# EAGLE design ev_emulator (EAGLE 9.2.2)
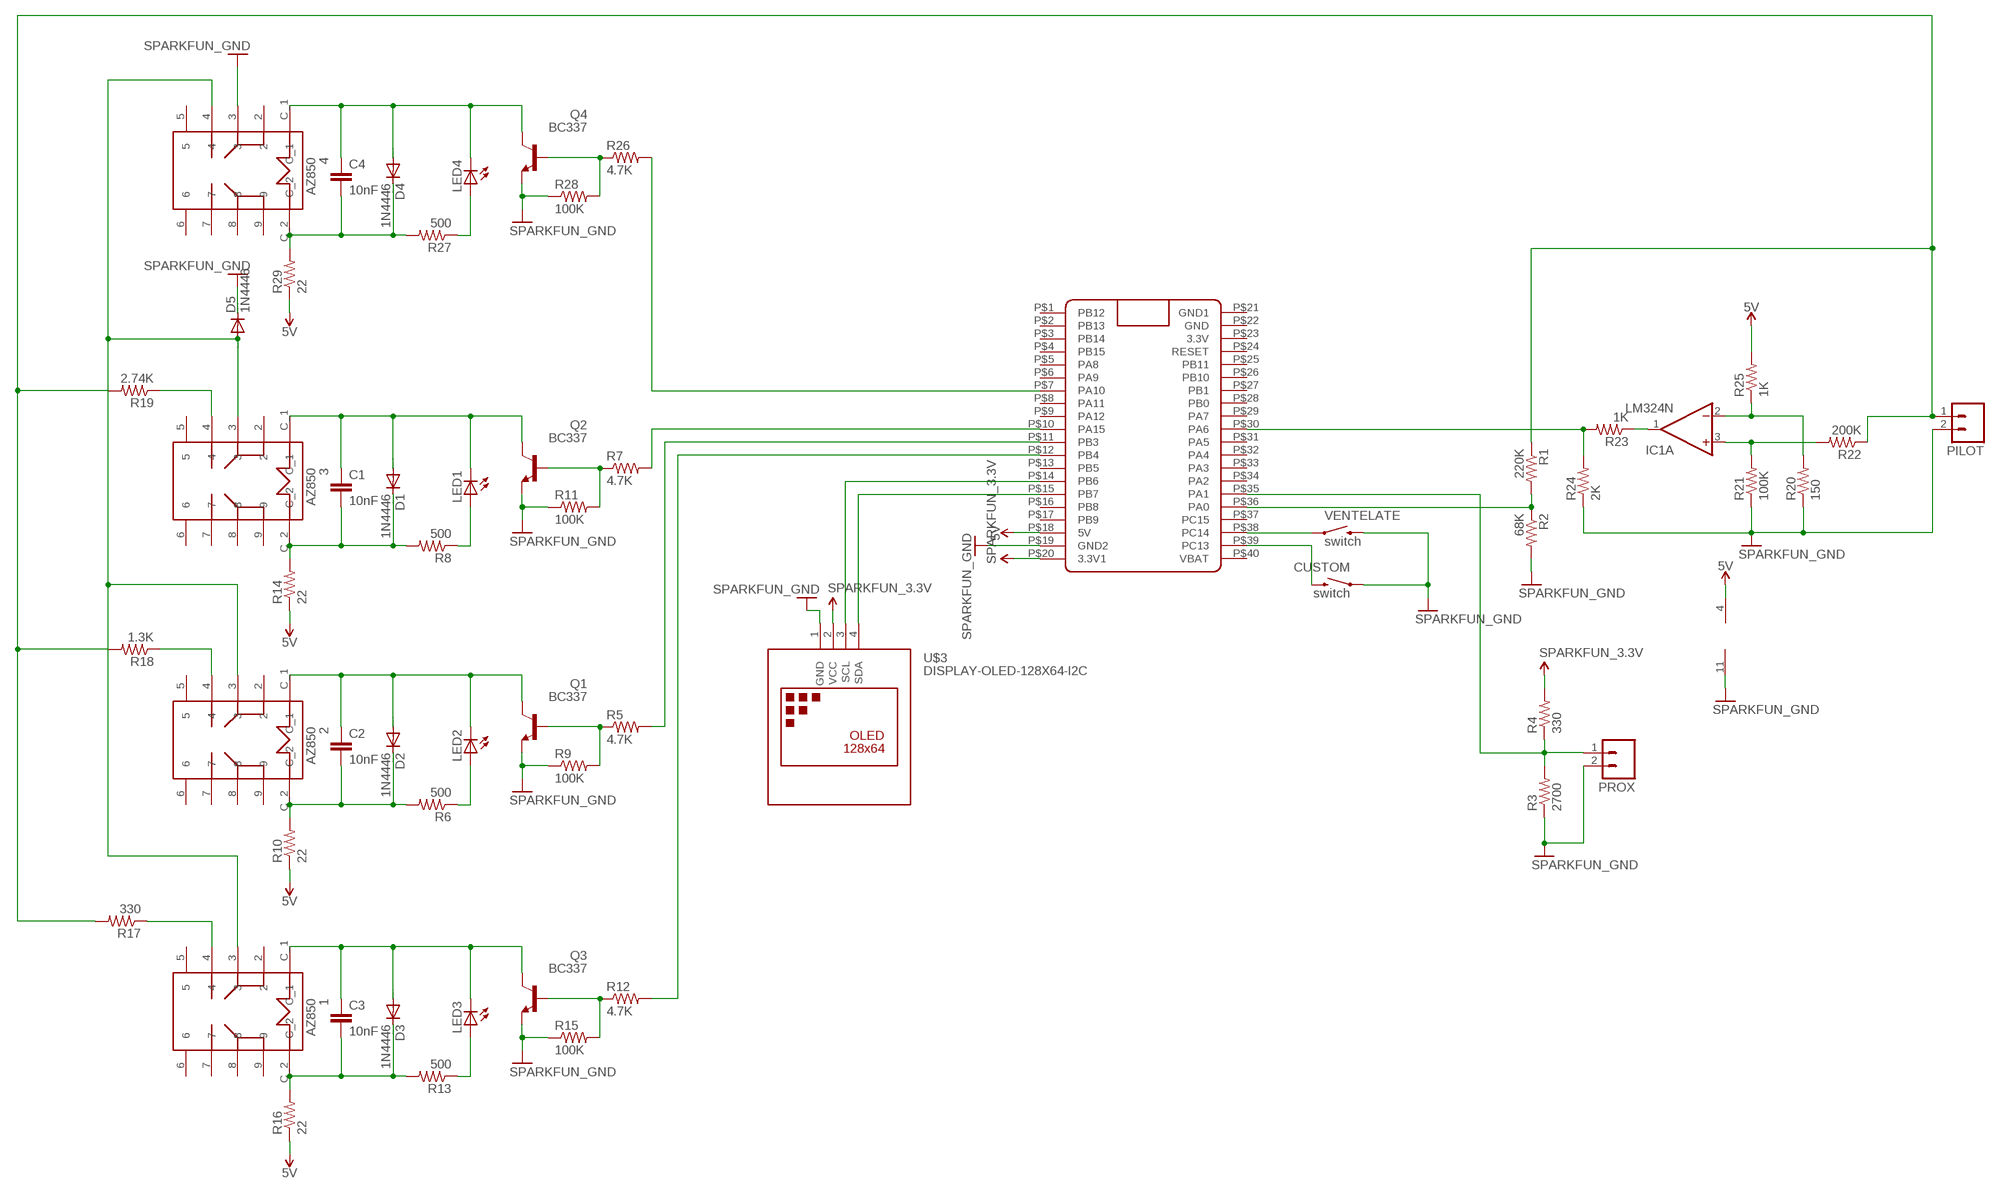
[diagram p0: schematic, sheet 1]

## Parts
1  AZ850  [AZ850]
2  AZ850  [AZ850]
3  AZ850  [AZ850]
4  AZ850  [AZ850]
C1  10nF  C2,5-3  [C2.5-3]
C2  10nF  C2,5-3  [C2.5-3]
C3  10nF  C2,5-3  [C2.5-3]
C4  10nF  C2,5-3  [C2.5-3]
CUSTOM  switch  SPARKFUN-ELECTROMECHANICAL_SWITCH-MOMENTARY-2PTH  [SPARKFUN-ELECTROMECHANICAL_TACTILE-PTH]
D1  1N4446  [DO35-10]
D2  1N4446  [DO35-10]
D3  1N4446  [DO35-10]
D4  1N4446  [DO35-10]
D5  1N4446  [DO35-10]
IC1  LM324N  [DIL14]
LED1  SPARKFUN_LED-3MM-NO_SILK  [SPARKFUN_LED3MM-NS]
LED2  SPARKFUN_LED-3MM-NO_SILK  [SPARKFUN_LED3MM-NS]
LED3  SPARKFUN_LED-3MM-NO_SILK  [SPARKFUN_LED3MM-NS]
LED4  SPARKFUN_LED-3MM-NO_SILK  [SPARKFUN_LED3MM-NS]
PILOT  SPARKFUN_M02POLAR  [SPARKFUN_MOLEX-1X2]
PROX  SPARKFUN_M02POLAR  [SPARKFUN_MOLEX-1X2]
Q1  BC337  [TO92]
Q2  BC337  [TO92]
Q3  BC337  [TO92]
Q4  BC337  [TO92]
R1  220K  SPARKFUN_RESISTORAXIAL-0.3  [SPARKFUN_AXIAL-0.3]
R2  68K  SPARKFUN_RESISTORAXIAL-0.3  [SPARKFUN_AXIAL-0.3]
R3  2700  SPARKFUN_RESISTORAXIAL-0.3  [SPARKFUN_AXIAL-0.3]
R4  330  SPARKFUN_RESISTORAXIAL-0.3  [SPARKFUN_AXIAL-0.3]
R5  4.7K  SPARKFUN_RESISTORAXIAL-0.3  [SPARKFUN_AXIAL-0.3]
R6  500  SPARKFUN_RESISTORAXIAL-0.3  [SPARKFUN_AXIAL-0.3]
R7  4.7K  SPARKFUN_RESISTORAXIAL-0.3  [SPARKFUN_AXIAL-0.3]
R8  500  SPARKFUN_RESISTORAXIAL-0.3  [SPARKFUN_AXIAL-0.3]
R9  100K  SPARKFUN_RESISTORAXIAL-0.3  [SPARKFUN_AXIAL-0.3]
R10  22  SPARKFUN_RESISTORAXIAL-0.3  [SPARKFUN_AXIAL-0.3]
R11  100K  SPARKFUN_RESISTORAXIAL-0.3  [SPARKFUN_AXIAL-0.3]
R12  4.7K  SPARKFUN_RESISTORAXIAL-0.3  [SPARKFUN_AXIAL-0.3]
R13  500  SPARKFUN_RESISTORAXIAL-0.3  [SPARKFUN_AXIAL-0.3]
R14  22  SPARKFUN_RESISTORAXIAL-0.3  [SPARKFUN_AXIAL-0.3]
R15  100K  SPARKFUN_RESISTORAXIAL-0.3  [SPARKFUN_AXIAL-0.3]
R16  22  SPARKFUN_RESISTORAXIAL-0.3  [SPARKFUN_AXIAL-0.3]
R17  330  SPARKFUN_RESISTORAXIAL-0.3  [SPARKFUN_AXIAL-0.3]
R18  1.3K  SPARKFUN_RESISTORAXIAL-0.3  [SPARKFUN_AXIAL-0.3]
R19  2.74K  SPARKFUN_RESISTORAXIAL-0.3  [SPARKFUN_AXIAL-0.3]
R20  150  SPARKFUN_RESISTORAXIAL-0.3  [SPARKFUN_AXIAL-0.3]
R21  100K  SPARKFUN_RESISTORAXIAL-0.3  [SPARKFUN_AXIAL-0.3]
R22  200K  SPARKFUN_RESISTORAXIAL-0.3  [SPARKFUN_AXIAL-0.3]
R23  1K  SPARKFUN_RESISTORAXIAL-0.3  [SPARKFUN_AXIAL-0.3]
R24  2K  SPARKFUN_RESISTORAXIAL-0.3  [SPARKFUN_AXIAL-0.3]
R25  1K  SPARKFUN_RESISTORAXIAL-0.3  [SPARKFUN_AXIAL-0.3]
R26  4.7K  SPARKFUN_RESISTORAXIAL-0.3  [SPARKFUN_AXIAL-0.3]
R27  500  SPARKFUN_RESISTORAXIAL-0.3  [SPARKFUN_AXIAL-0.3]
R28  100K  SPARKFUN_RESISTORAXIAL-0.3  [SPARKFUN_AXIAL-0.3]
R29  22  SPARKFUN_RESISTORAXIAL-0.3  [SPARKFUN_AXIAL-0.3]
U$1  BLUE_PILL  [BLUE_PILL]
U$3  DISPLAY-OLED-128X64-I2C  [DISPLAY-OLED-128X64-I2C]
VENTELATE  switch  SPARKFUN-ELECTROMECHANICAL_SWITCH-MOMENTARY-2PTH  [SPARKFUN-ELECTROMECHANICAL_TACTILE-PTH]

## Nets
3.3V: R4.P$2 U$1.P$20(3.3V1) U$3.2(VCC) ; supply symbol labelled SPARKFUN_3.3V
5V: IC1.4(P:V+) R10.P$1 R14.P$1 R16.P$1 R25.P$2 R29.P$1 U$1.P$18(5V)
GND: 4.3 CUSTOM.1 D5.C IC1.11(P:V-) PILOT.2 PROX.2 Q1.1(E) Q2.1(E) Q3.1(E) Q4.1(E) R2.P$2 R3.P$1 R9.P$1 R11.P$1 R15.P$1 R20.P$1 R21.P$1 R24.P$1 R28.P$1 U$1.P$19(GND2) U$3.1(GND) VENTELATE.3 ; supply symbol labelled SPARKFUN_GND
N$1: R26.P$2 U$1.P$7(PA10)
N$2: R1.P$2 R2.P$1 U$1.P$36(PA0)
N$3: PROX.1 R3.P$2 R4.P$1 U$1.P$35(PA1)
N$4: Q2.2(B) R7.P$1 R11.P$2
N$5: R12.P$2 U$1.P$12(PB4)
N$6: 3.C_1(С_1) C1.1 D1.A LED1.K(C) Q2.3(C)
N$7: 3.C_2(С_2) C1.2 D1.C R8.P$2 R14.P$2
N$8: R5.P$2 U$1.P$11(PB3)
N$9: R7.P$2 U$1.P$10(PA15)
N$10: LED1.A R8.P$1
N$11: Q1.2(B) R5.P$1 R9.P$2
N$12: 2.C_1(С_1) C2.1 D2.A LED2.K(C) Q1.3(C)
N$13: U$1.P$38(PC14) VENTELATE.1
N$14: U$1.P$15(PB7) U$3.4(SDA)
N$15: U$1.P$14(PB6) U$3.3(SCL)
N$16: 2.C_2(С_2) C2.2 D2.C R6.P$2 R10.P$2
N$17: CUSTOM.3 U$1.P$39(PC13)
N$18: LED2.A R6.P$1
N$19: Q3.2(B) R12.P$1 R15.P$2
N$20: 1.C_1(С_1) C3.1 D3.A LED3.K(C) Q3.3(C)
N$21: 1.C_2(С_2) C3.2 D3.C R13.P$2 R16.P$2
N$22: LED3.A R13.P$1
N$23: 1.4 R17.P$1
N$24: R23.P$2 R24.P$2 U$1.P$30(PA6)
N$25: 2.4 R18.P$1
N$26: 3.4 R19.P$1
N$27: IC1.3(A:+IN) R21.P$2 R22.P$2
N$28: PILOT.1 R1.P$1 R17.P$2 R18.P$2 R19.P$2 R22.P$1
N$29: IC1.2(A:-IN) R20.P$2 R25.P$1
N$30: IC1.1(A:OUT) R23.P$1
N$31: Q4.2(B) R26.P$1 R28.P$2
N$32: 4.C_1(С_1) C4.1 D4.A LED4.K(C) Q4.3(C)
N$33: 4.C_2(С_2) C4.2 D4.C R27.P$2 R29.P$2
N$34: LED4.A R27.P$1
N$36: 1.3 2.3 3.3 4.4 D5.A
Unconnected: 1.2 1.5 1.6 1.7 1.8 1.9 2.2 2.5 2.6 2.7 2.8 2.9 3.2 3.5 3.6 3.7 3.8 3.9 4.2 4.5 4.6 4.7 4.8 4.9 IC1.5(B:+IN) IC1.6(B:-IN) IC1.7(B:OUT) IC1.8(C:OUT) IC1.9(C:-IN) IC1.10(C:+IN) IC1.12(D:+IN) IC1.13(D:-IN) IC1.14(D:OUT) U$1.P$1(PB12) U$1.P$2(PB13) U$1.P$3(PB14) U$1.P$4(PB15) U$1.P$5(PA8) U$1.P$6(PA9) U$1.P$8(PA11) U$1.P$9(PA12) U$1.P$13(PB5) U$1.P$16(PB8) U$1.P$17(PB9) U$1.P$22(GND) U$1.P$23(3.3V) U$1.P$24(RESET) U$1.P$25(PB11) U$1.P$26(PB10) U$1.P$27(PB1) U$1.P$28(PB0) U$1.P$29(PA7) U$1.P$31(PA5) U$1.P$32(PA4) U$1.P$33(PA3) U$1.P$34(PA2) U$1.P$37(PC15) U$1.P$40(VBAT)

## Power pins joined to a net without a drawn wire
GND1: U$1.P$21(GND1)

## Library data of the parts
1-4 = AZ850:AZ850
C1-C4 = capacitor-wima:C: CAPACITOR naming: grid - package width
CUSTOM VENTELATE = antduino:SPARKFUN-ELECTROMECHANICAL_SWITCH-MOMENTARY-2: Various NO switches- pushbuttons, reed, etc
D1-D5 = diode:1N4446: DIODE high speed (Philips)
IC1 = linear:LM324: OP AMP
LED1-LED4 = antduino:SPARKFUN_LED: LEDs Standard schematic elements and footprints for 5mm, 3mm, 1206, and 0603 sized LEDs. 5mm - Spark Fun Electronics SKU : COM-00529 (and others)
PILOT PROX = antduino:SPARKFUN_M02: Header 2 Standard 2-pin 0.1" header. Use with straight break away headers (SKU : PRT-00116), right angle break away headers (PRT-00553), swiss pins (PRT-00743), machine pins (PRT-00117), and female headers (PRT-00115). Molex polarized connector foot print use with SKU : PRT-08233 with associated crimp pins and housings.
Q1-Q4 = transistor-npn:BC337*: NPN Transistor
R1-R29 = antduino:SPARKFUN_RESISTOR: Resistor Basic schematic elements and footprints for 0603, 1206, and PTH resistors.
U$1 = BluePill:BLUE_PILL
U$3 = diy-modules:DISPLAY-OLED-128X64-I2C: 128x64 Dot Matrix OLED Module based on SSD1306 chip Variant with I2C interface More details available here: http://www.instructables.com/id/Monochrome-096-i2c-OLED-display-with-arduino-SSD13/ SSD1306 datasheet: https://cdn-shop.adafruit.com/datasheets/SSD1306.pdf Click here to find device on ebay.com <http://www.ebay.com/sch/oled+display+128x64+iic> Note: There are two variants: I2C and SPI. Search for the proper version.

## Board
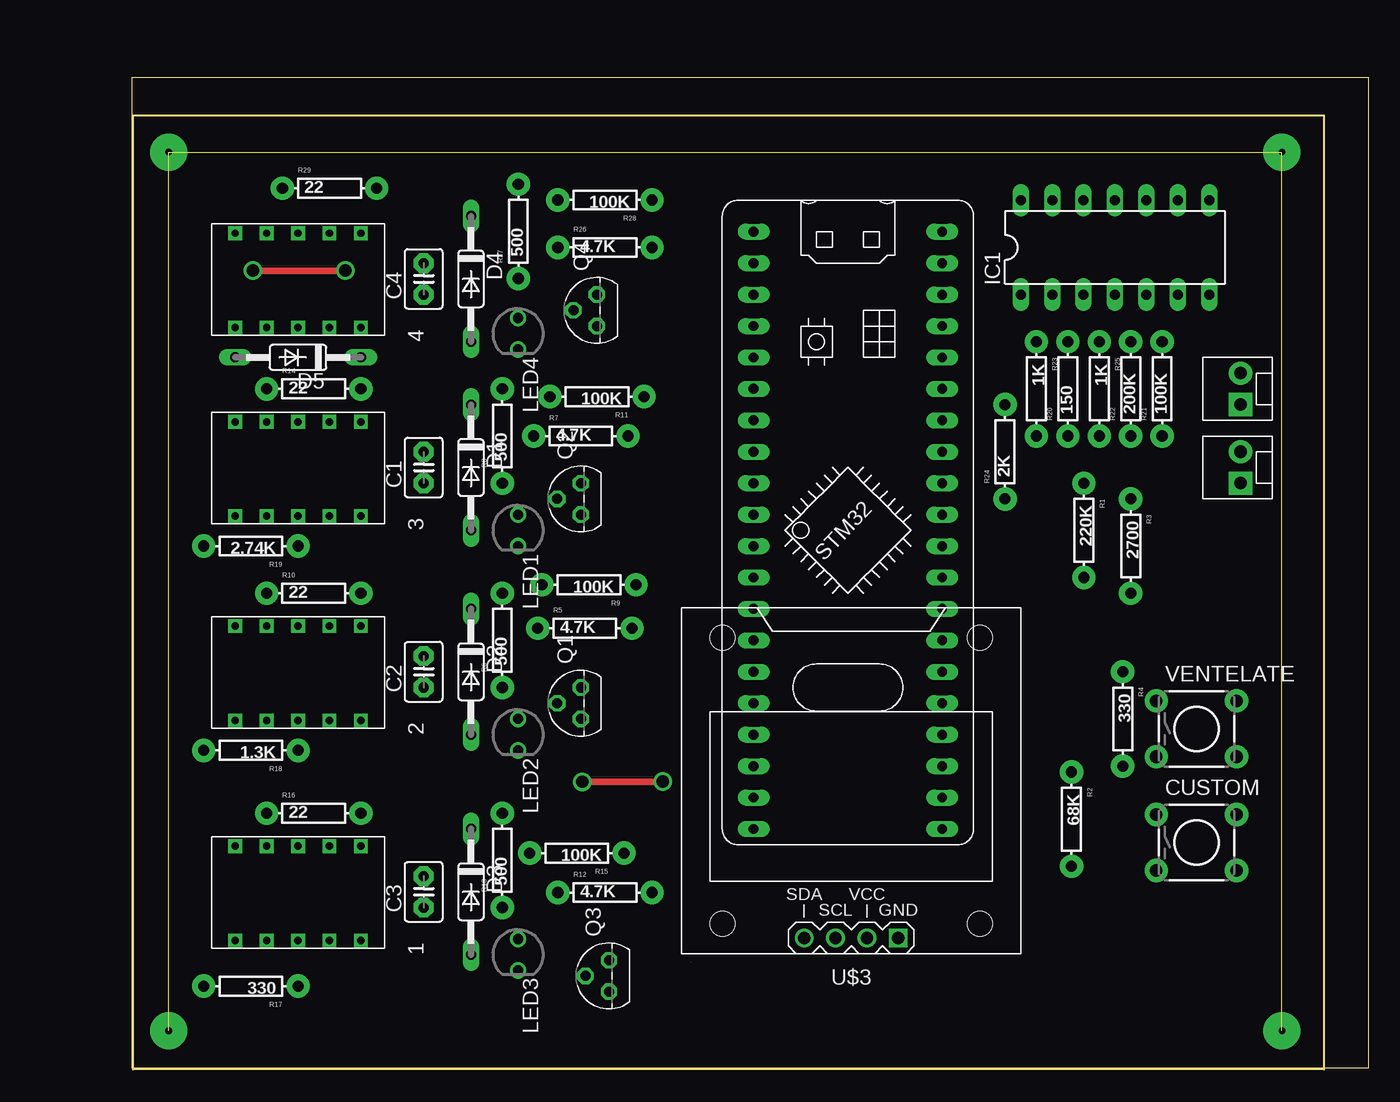
[diagram p1: board, top side]
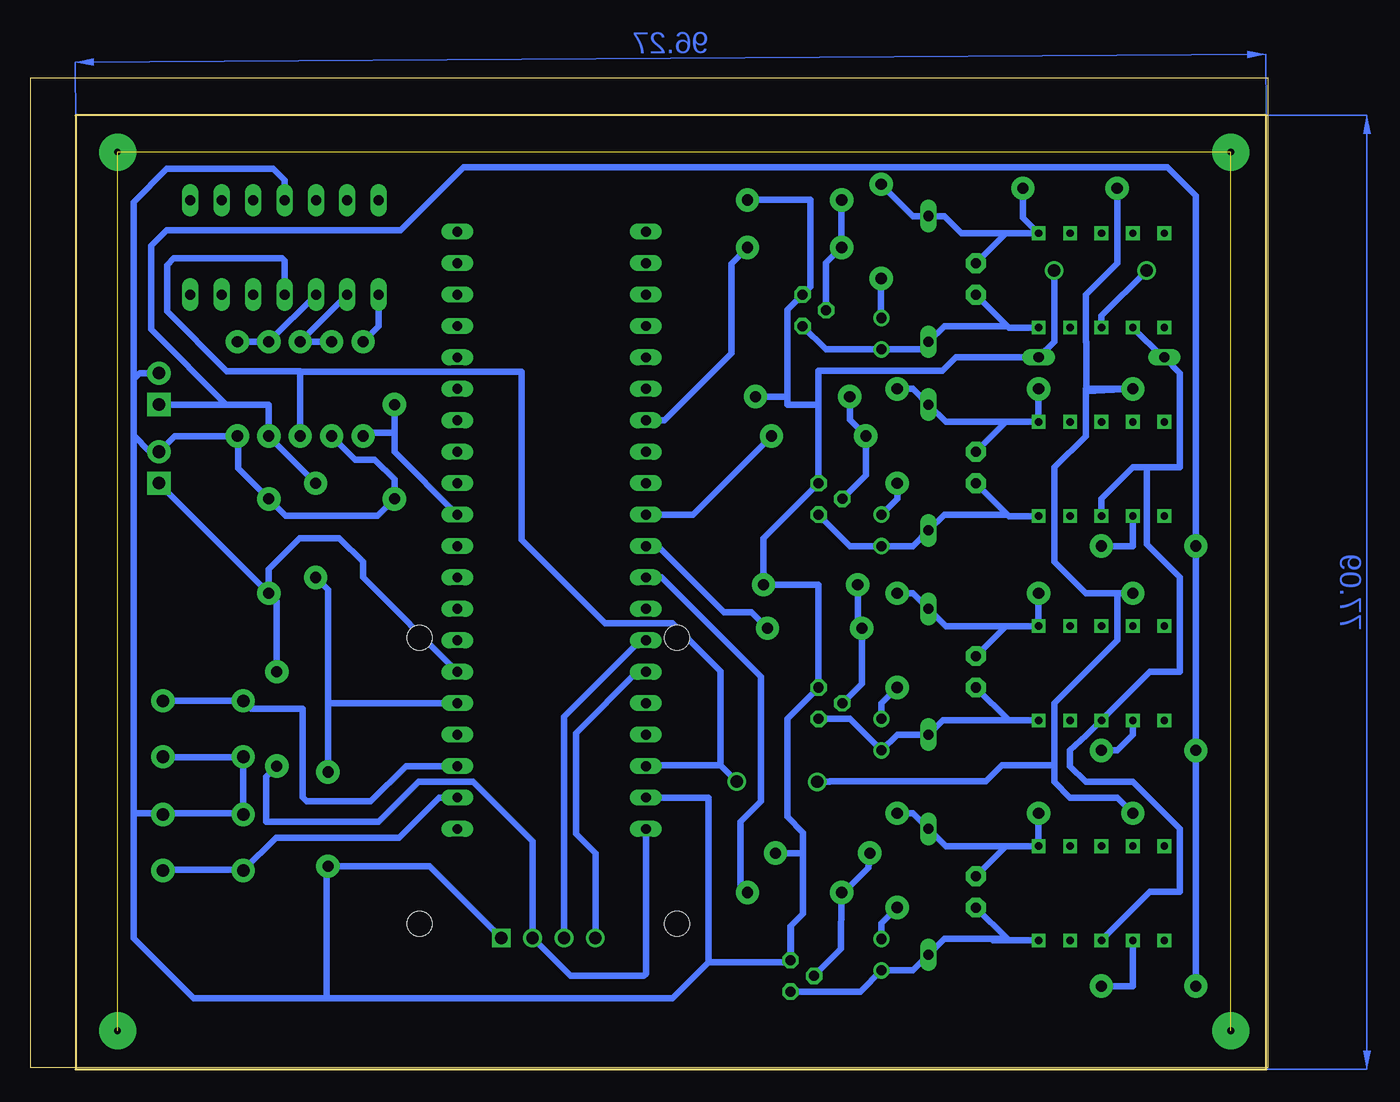
[diagram p2: board, bottom side, seen from below]

Size 100 x 80 mm. Coordinates in mm from the lower left corner, seen from the top.
Outline: 0,0 100,0 100,80 0,80 0,0
Copper layers (1*16): Top 0.035mm / dielectric 1.5mm / Bottom 0.035mm
Design rules "default": minimum track width 6mil, minimum drill 0.35mm, track to track 6mil, track to pad 6mil, pad to pad 6mil, via to via 6mil, smd to smd 6mil, copper to edge 40mil, drill to drill 6mil, minimum pad ring 10mil, minimum via ring 8mil, stop-mask expansion 4mil, vias tented up to drill 0mil, thermal gap 10mil
Milling: 4 lines

### Footprints (pad centres in the part's own frame; a part is rotated, then mirrored left to right if it is on the bottom)
AZ850 = drill 0.6 square: 2 -3.93,-2.54; 3 -3.93,0; 4 -3.93,2.54; 5 -3.93,5.08; 6 3.69,5.08; 7 3.69,2.54; 8 3.69,0; 9 3.69,-2.54; C_1 -3.93,-5.08; C_2 3.69,-5.08
C2.5-3 = drill 0.813 pad 1.6 octagon: 1 -1.27,0; 2 1.27,0
SPARKFUN-ELECTROMECHANICAL_TACTILE-PTH = drill 1.016 pad 1.88: 1 -3.251,2.261; 2 3.251,2.261; 3 -3.251,-2.261; 4 3.251,-2.261
DO35-10 = drill 0.813 long: A 5.08,0; C -5.08,0
DIL14 = drill 0.813 long: 1 -7.62,-3.81; 2 -5.08,-3.81; 3 -2.54,-3.81; 4 0,-3.81; 5 2.54,-3.81; 6 5.08,-3.81; 7 7.62,-3.81; 8 7.62,3.81; 9 5.08,3.81; 10 2.54,3.81; 11 0,3.81; 12 -2.54,3.81; 13 -5.08,3.81; 14 -7.62,3.81
SPARKFUN_LED3MM-NS = drill 0.813: A -1.27,0; K 1.27,0
SPARKFUN_MOLEX-1X2 = drill 1.016 pad 1.88 square: 1 0,0 | drill 1.016 pad 1.88: 2 2.54,0
TO92 = drill 0.813 octagon: 1 1.27,0; 2 0,1.905; 3 -1.27,0
SPARKFUN_AXIAL-0.3 = drill 0.9 pad 1.88: P$1 -3.81,0; P$2 3.81,0
BLUE_PILL = drill 0.8 long: P$1 -7.62,15.24; P$2 -7.62,12.7; P$3 -7.62,10.16; P$4 -7.62,7.62; P$5 -7.62,5.08; P$6 -7.62,2.54; P$7 -7.62,0; P$8 -7.62,-2.54; P$9 -7.62,-5.08; P$10 -7.62,-7.62; P$11 -7.62,-10.16; P$12 -7.62,-12.7; P$13 -7.62,-15.24; P$14 -7.62,-17.78; P$15 -7.62,-20.32; P$16 -7.62,-22.86; P$17 -7.62,-25.4; P$18 -7.62,-27.94; P$19 -7.62,-30.48; P$20 -7.62,-33.02; P$21 7.62,15.24; P$22 7.62,12.7; P$23 7.62,10.16; P$24 7.62,7.62; P$25 7.62,5.08; P$26 7.62,2.54; P$27 7.62,0; P$28 7.62,-2.54; P$29 7.62,-5.08; P$30 7.62,-7.62; P$31 7.62,-10.16; P$32 7.62,-12.7; P$33 7.62,-15.24; P$34 7.62,-17.78; P$35 7.62,-20.32; P$36 7.62,-22.86; P$37 7.62,-25.4; P$38 7.62,-27.94; P$39 7.62,-30.48; P$40 7.62,-33.02
DISPLAY-OLED-128X64-I2C = drill 1 square: 1 -3.81,12.7 | drill 1: 2 -1.27,12.7; 3 1.27,12.7; 4 3.81,12.7 | hole 2: -10.414,11.557; 10.414,11.557; 10.414,-11.557; -10.414,-11.557

### Placement (x,y rotation side)
1  13.46,14.22 90 top
2  13.46,32 90 top
3  13.46,48.51 90 top
4  13.46,63.75 90 top
C1  23.62,48.51 90 top
C2  23.62,32 90 top
C3  23.62,14.22 90 top
C4  23.62,63.75 90 top
CUSTOM  86.09,18.21 0 top
D1  27.43,48.51 270 top
D2  27.43,32 270 top
D3  27.43,14.22 270 top
D4  27.43,63.75 270 top
D5  13.46,57.4 180 top
IC1  79.5,66.29 0 top
LED1  31.24,43.43 270 top
LED2  31.24,26.92 270 top
LED3  31.24,9.14 270 top
LED4  31.24,59.32 270 top
PILOT  89.66,53.59 90 top
PROX  89.66,47.24 90 top
Q1  36.32,29.46 90 top
Q2  36.32,45.97 90 top
Q3  38.6,7.43 90 top
Q4  37.62,61.21 90 top
R1  76.99,43.43 270 top
R2  75.99,20.1 270 top
R3  80.77,42.16 270 top
R4  80.12,28.19 270 top
R5  36.65,35.52 0 top
R6  29.97,34.54 90 top
R7  36.32,51.05 0 top
R8  29.97,51.05 90 top
R9  36.97,39.03 180 top
R10  14.73,38.35 0 top
R11  37.62,54.24 180 top
R12  38.27,14.16 0 top
R13  29.97,16.76 90 top
R14  14.73,54.86 0 top
R15  36,17.35 180 top
R16  14.73,20.57 0 top
R17  9.65,6.6 180 top
R18  9.65,25.65 180 top
R19  9.65,42.16 180 top
R20  75.69,54.86 90 top
R21  83.31,54.86 90 top
R22  80.77,54.86 90 top
R23  73.15,54.86 270 top
R24  70.61,49.78 90 top
R25  78.23,54.86 270 top
R26  38.27,66.29 0 top
R27  31.27,67.59 90 top
R28  38.27,70.13 180 top
R29  16,71.08 0 top
U$1  57.91,52.32 0 top
U$3  58.18,23.2 180 top
VENTELATE  86.09,27.4 0 top

### Tracks (layer width: path | path; a pad name or v marks a point on that pad's centre or on a via)
3.3V
  Bottom 0.508: 79.8,24.38 R4.P$2 80.98,23.53 80.98,19.9 71.88,19.9 68.67,23.11 64.26,23.11 59.45,18.3 U$3.2 56.37,7.43 50.47,7.43 50.29,7.6 U$1.P$20
5V  (via drill 1 pad 0.55)
  Top 0.508: v36.45,23.11 42.93,23.11 42.93,23.13 v42.95,23.15
  Bottom 0.508: R16.P$1 12.19,21.84 16,21.84 17.27,23.11 17.27,24.45 | 17.27,24.45 17.27,29.46 12.19,34.54 12.19,38.35 | R10.P$1 12.19,38.35 | 12.19,38.35 14.73,38.35 17.27,40.89 17.27,48.51 14.73,51.05 14.73,54.86 R14.P$1 14.68,54.68 14.68,58.62 14.73,58.67 14.73,62.48 12.19,65.02 R29.P$1 | 17.27,24.45 21.5,24.45 22.8,23.15 35.39,23.15 35.43,23.11 v36.45,23.11 | v42.95,23.15 44.25,24.45 | 44.25,24.45 50.22,24.45 | 50.22,24.45 U$1.P$18 | R25.P$2 78.23,56.3 78.36,56.3 | 50.75,24.45 50.22,24.45 | IC1.4 79.5,65.23 79.68,65.4 88.45,65.4 88.99,64.87 88.99,61.13 84.16,56.3 78.36,56.3 | 44.25,24.45 44.25,32.06 48.13,35.94 53.59,35.94 60.33,42.67 60.33,56.26 78.32,56.26 78.36,56.3
GND  (via drill 1 pad 0.55)  (1 unrouted)
  Top 0.508: v9.8,64.43 17.23,64.43 17.27,64.39 17.28,64.39 v17.28,64.43
  Bottom 0.508: VENTELATE.3 CUSTOM.1 arc-90 82.92,20.55 91.7,20.55 | VENTELATE.3 82.84,25.09 | 76.1,5.6 86.83,5.6 91.7,10.48 91.7,20.55 | 76.1,5.6 49.46,5.6 49.44,5.62 49.11,5.62 49.13,5.6 48.15,5.6 45.21,8.53 | U$1.P$19 45.21,21.84 45.21,8.55 38.57,8.55 38.57,11.47 | 37.59,17.35 37.59,19.01 38.86,20.28 38.86,28.19 Q1.1 36.32,39.03 R9.P$1 40.78,42.78 Q2.1 36.32,53.59 | 37.59,17.35 37.59,12.45 38.57,11.47 | 36.32,53.59 36.32,56.34 26.3,56.34 25.23,57.4 D5.C 17.28,58.67 v17.28,64.43 | 36.32,53.59 38.86,53.59 38.86,54.24 | 38.86,54.24 R11.P$1 | 38.86,54.24 38.86,61.24 Q4.1 36.97,63.13 36.97,70.13 R28.P$1 | PILOT.2 91.22,56.13 91.7,55.65 | 91.7,55.65 91.7,51.1 | 91.7,51.1 90.38,49.78 PROX.2 88.39,51.05 R21.P$1 83.25,50.99 83.25,48.45 R3.P$1 79.4,44.6 71.98,44.6 R24.P$1 70.61,47.56 72.2,49.15 73.79,49.15 R20.P$1 | 91.7,20.55 91.7,51.1 | v9.8,64.43 13.46,60.77 4.3 | Q3.1 38.6,11.44 38.57,11.47 | R15.P$1 37.59,17.35 | IC1.11 79.5,71.73 80.41,72.63 89.02,72.63 91.7,69.95 91.7,55.65 | U$3.1 67.77,16.29 R2.P$2 arc-90 76.1,16.17 76.1,5.6 | 89.43,25.1 82.87,25.1 VENTELATE.3
N$1
  Bottom 0.508: R26.P$2 43.38,64.99 43.38,57.73 48.79,52.32 U$1.P$7
N$2
  Bottom 0.508: R1.P$2 75.99,38.62 75.99,29.33 | 75.99,29.33 R2.P$1 | U$1.P$36 75.85,29.46 75.99,29.33
N$3
  Bottom 0.508: R3.P$2 80.12,37.7 R4.P$1 | PROX.1 R3.P$2 | R3.P$2 80.77,40.3 78.26,42.81 75.07,42.81 73.15,40.89 73.15,39.62 U$1.P$35
N$4
  Bottom 0.508: Q2.2 32.51,47.88 R7.P$1 33.81,52.35 R11.P$2
N$5
  Bottom 0.508: U$1.P$12 49.02,39.62 41,31.6 41,21.53 42.63,19.9 42.63,14.71 R12.P$2
N$6
  Bottom 0.508: C1.1 21.08,44.7 | 3.C_1 20.96,44.58 21.08,44.7 | 21.08,44.7 26.16,44.7 D1.A 28.7,42.16 LED1.K 33.78,42.16 Q2.3
N$7
  Bottom 0.508: R14.P$2 3.C_2 21.2,52.2 | C1.2 21.2,52.2 | 21.2,52.2 26.04,52.2 D1.C 28.7,54.86 R8.P$2
N$8
  Bottom 0.508: U$1.P$11 49.32,42.16 43.97,36.82 41.76,36.82 R5.P$2
N$9
  Bottom 0.508: R7.P$2 46.48,44.7 U$1.P$10
N$10
  Bottom 0.508: R8.P$1 29.97,45.97 LED1.A
N$11
  Bottom 0.508: R9.P$2 33.16,35.84 R5.P$1 32.84,31.04 Q1.2
N$12
  Bottom 0.508: 20.96,28.07 2.C_1 | C2.1 20.96,28.07 | 20.96,28.07 26.28,28.07 D2.A 29.97,26.92 LED2.K 33.78,28.19 Q1.3
N$13
  Bottom 0.508: U$1.P$38 69.67,24.38 72.53,21.53 77.73,21.53 78.05,21.85 78.05,29 78.06,29.01 82.19,29.01 VENTELATE.1 89.1,29.65
N$14
  Bottom 0.508: U$3.4 54.37,17.34 55.95,18.93 55.95,27.05 51,32 U$1.P$15
N$15
  Bottom 0.508: U$3.3 56.91,28.37 50.74,34.54 U$1.P$14
N$16
  Bottom 0.508: C2.2 21.2,35.69 | 21.2,35.69 2.C_2 R10.P$2 | 21.2,35.69 26.04,35.69 D2.C 28.7,38.35 R6.P$2
N$17
  Bottom 0.508: U$1.P$39 67.01,21.84 70.25,18.6 80.19,18.6 CUSTOM.3 82.89,16 89.43,16
N$18
  Bottom 0.508: R6.P$1 31.24,29.46 LED2.A
N$19
  Bottom 0.508: Q3.2 34.51,9.62 R12.P$1 34.37,14.26 34.16,14.31 32.31,16.16 R15.P$2
N$20
  Bottom 0.508: C3.1 21.08,10.41 22.35,10.41 | 1.C_1 22.23,10.29 22.35,10.41 | 22.35,10.41 26.16,10.41 D3.A 28.7,7.87 LED3.K 32.96,6.16 Q3.3
N$21
  Bottom 0.508: C3.2 21.2,17.91 | 21.2,17.91 1.C_2 R16.P$2 | 21.2,17.91 26.04,17.91 D3.C 28.7,20.57 R13.P$2
N$22
  Bottom 0.508: LED3.A 31.24,11.68 R13.P$1
N$23
  Bottom 0.508: 1.4 10.92,6.6 R17.P$1
N$24
  Bottom 0.508: R23.P$2 72.88,51.32 70.61,51.32 | R24.P$2 70.61,51.32 | 70.61,51.32 70.61,49.78 U$1.P$30
N$25
  Bottom 0.508: R18.P$1 12.19,25.65 10.92,26.92 2.4
N$26
  Bottom 0.508: R19.P$1 10.92,42.16 3.4
N$27
  Bottom 0.508: IC1.3 R22.P$2 R21.P$2
N$28
  Bottom 0.508: R17.P$2 R18.P$2 R19.P$2 5.84,70.48 8.13,72.77 65.02,72.77 70.1,67.69 89.03,67.69 90.3,66.42 90.3,59.69 84.2,53.59 | 84.2,53.59 80.77,53.59 R22.P$1 80.77,51.02 R1.P$1 | 84.2,53.59 PILOT.1
N$29
  Bottom 0.508: IC1.2 R25.P$1 R20.P$2
N$30
  Bottom 0.508: R23.P$1 71.88,59.94 IC1.1
N$31
  Bottom 0.508: R28.P$2 R26.P$1 35.72,65.04 Q4.2
N$32
  Bottom 0.508: 4.C_1 20.96,59.82 21.08,59.94 | C4.1 21.08,59.94 | 21.08,59.94 26.16,59.94 D4.A 28.05,58.05 LED4.K 35.73,58.05 Q4.3
N$33
  Bottom 0.508: R29.P$2 19.81,68.71 4.C_2 21.2,67.44 | C4.2 21.2,67.44 | 21.2,67.44 24.77,67.44 26.16,68.83 D4.C 28.7,68.83 R27.P$2
N$34
  Bottom 0.508: R27.P$1 31.27,60.62 LED4.A
N$35  (via drill 0.55 pad 3)  (3 unrouted)
  other vias: 3,74 3,3 93,3 93,74
N$36
  Bottom 0.508: 4.4 8.5,57.4 D5.A 7.11,56.13 7.11,48.51 9.8,48.51 | 9.8,48.51 10.92,48.51 13.46,45.97 3.3 13.58,44.58 | 1.3 9.53,14.22 7.11,14.22 7.11,19.3 10.92,23.11 14.73,23.11 16,24.38 16,25.65 14.67,26.86 2.3 9.53,32 7.11,32 7.11,39.62 9.8,42.31 9.8,48.51
(copper drawn outside any net)
  shapes: Bottom area x2